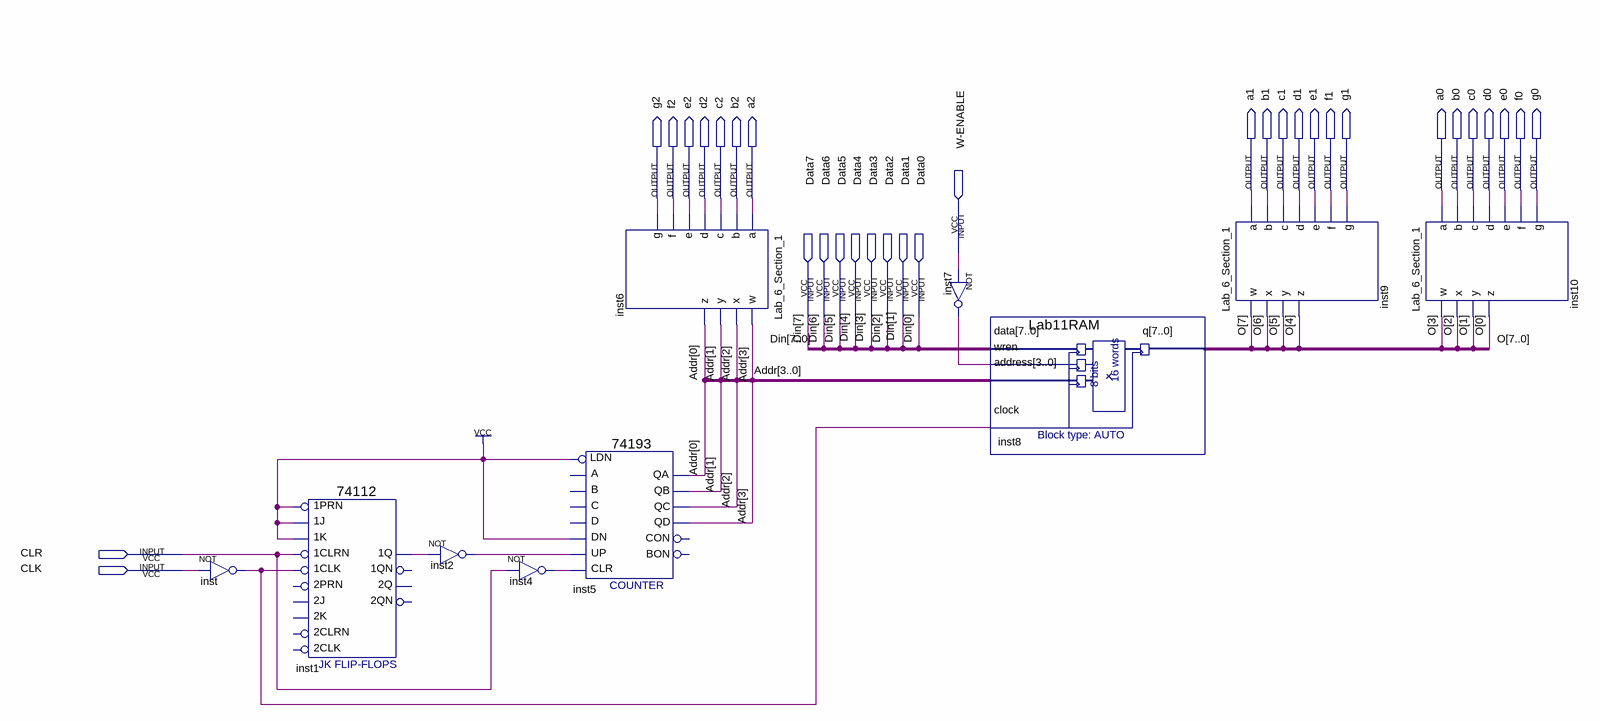
[diagram p0: schematic sheet]
// Quartus schematic RAM_Tester.bdf as structural Verilog: 10 symbols, 32 pins
module RAM_Tester (
  input  \W-ENABLE ,
  input  Data7,
  input  Data6,
  input  Data5,
  input  Data4,
  input  Data3,
  input  Data2,
  input  Data1,
  input  Data0,
  input  CLR,
  input  CLK,
  output a1,
  output b1,
  output c1,
  output d1,
  output e1,
  output f1,
  output g1,
  output a0,
  output b0,
  output c0,
  output d0,
  output e0,
  output f0,
  output g0,
  output g2,
  output f2,
  output e2,
  output d2,
  output c2,
  output b2,
  output a2
);

  wire inst1_1q, inst2_out, inst4_out, inst7_out, inst_out;
  wire [3:0] Addr;
  wire [7:0] O;

  not inst (inst_out, CLK);
  \74112  inst1 (
    .\1K (1'b1), .\1J (1'b1), .\1PRN (1'b1), .\1CLK (inst_out), .\1CLRN (CLR), .\1Q (inst1_1q));  // open: 2K, 2J, 2PRN, 2CLK, 2CLRN, 1QN, 2Q, 2QN
  not inst2 (inst2_out, inst1_1q);
  not inst4 (inst4_out, CLR);
  Lab_6_Section_1 inst6 (
    .w(Addr[3]), .x(Addr[2]), .y(Addr[1]), .z(Addr[0]), .a(a2), .b(b2), .c(c2), .d(d2), .e(e2), .f(f2), .g(g2));
  \74193  inst5 (
    .CLR(inst4_out), .UP(inst2_out), .DN(1'b1), .LDN(1'b1), .QB(Addr[1]), .QA(Addr[0]), .QD(Addr[3]),
    .QC(Addr[2]));  // open: D, C, B, A, CON, BON
  not inst7 (inst7_out, \W-ENABLE );
  Lab11RAM inst8 (
    .data({Data7, Data6, Data5, Data4, Data3, Data2, Data1, Data0}), .wren(inst7_out), .address(Addr),
    .clock(inst_out), .q(O));
  Lab_6_Section_1 inst9 (
    .w(O[7]), .x(O[6]), .y(O[5]), .z(O[4]), .a(a1), .b(b1), .c(c1), .d(d1), .e(e1), .f(f1), .g(g1));
  Lab_6_Section_1 inst10 (
    .w(O[3]), .x(O[2]), .y(O[1]), .z(O[0]), .a(a0), .b(b0), .c(c0), .d(d0), .e(e0), .f(f0), .g(g0));

  // Other names for the same wires on the sheet: Din[7:0] = {Data7, Data6, Data5, Data4, Data3, Data2, Data1, Data0}
endmodule
